# EasyEDA Pro project 主控基板_正式.epro, board 主控基板_正式
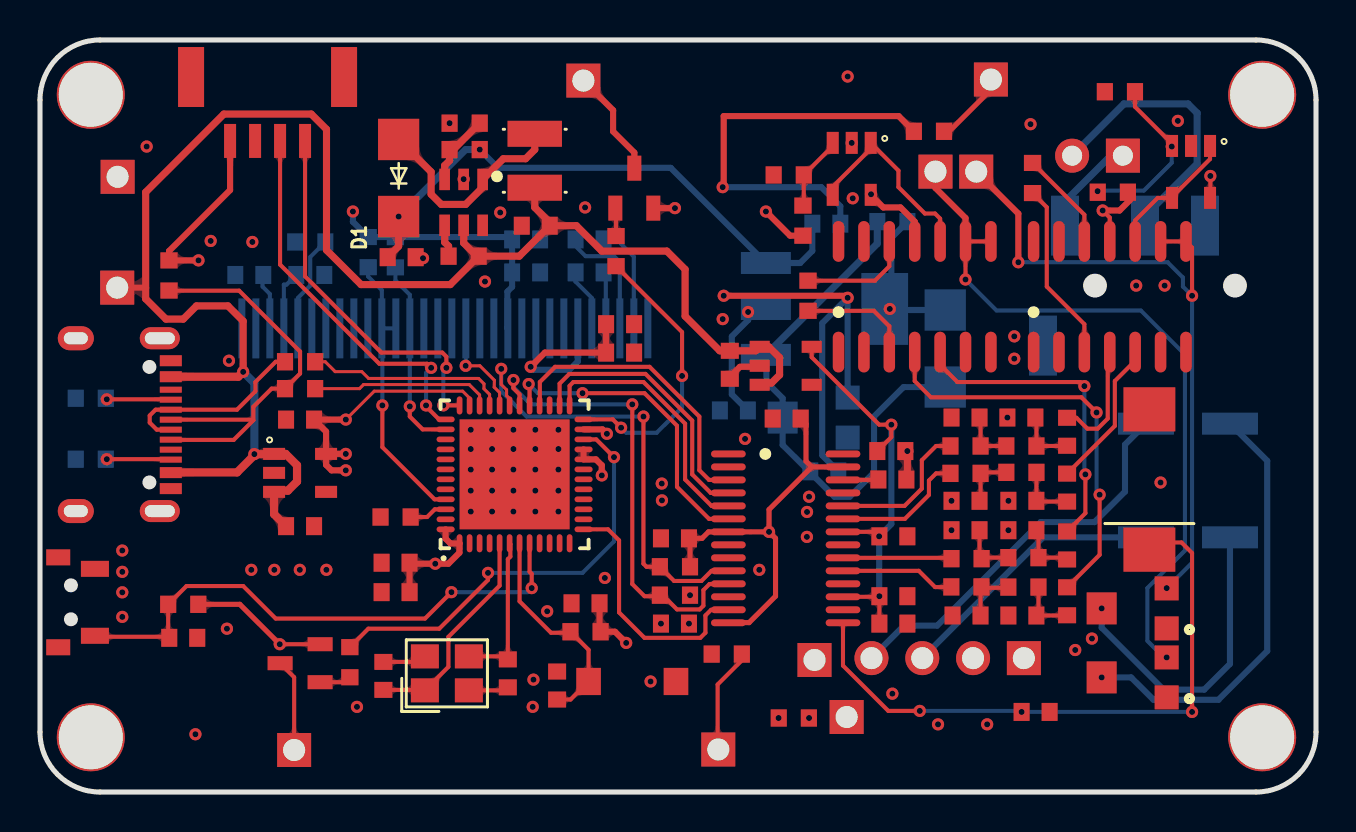
[diagram p1: board, top side]
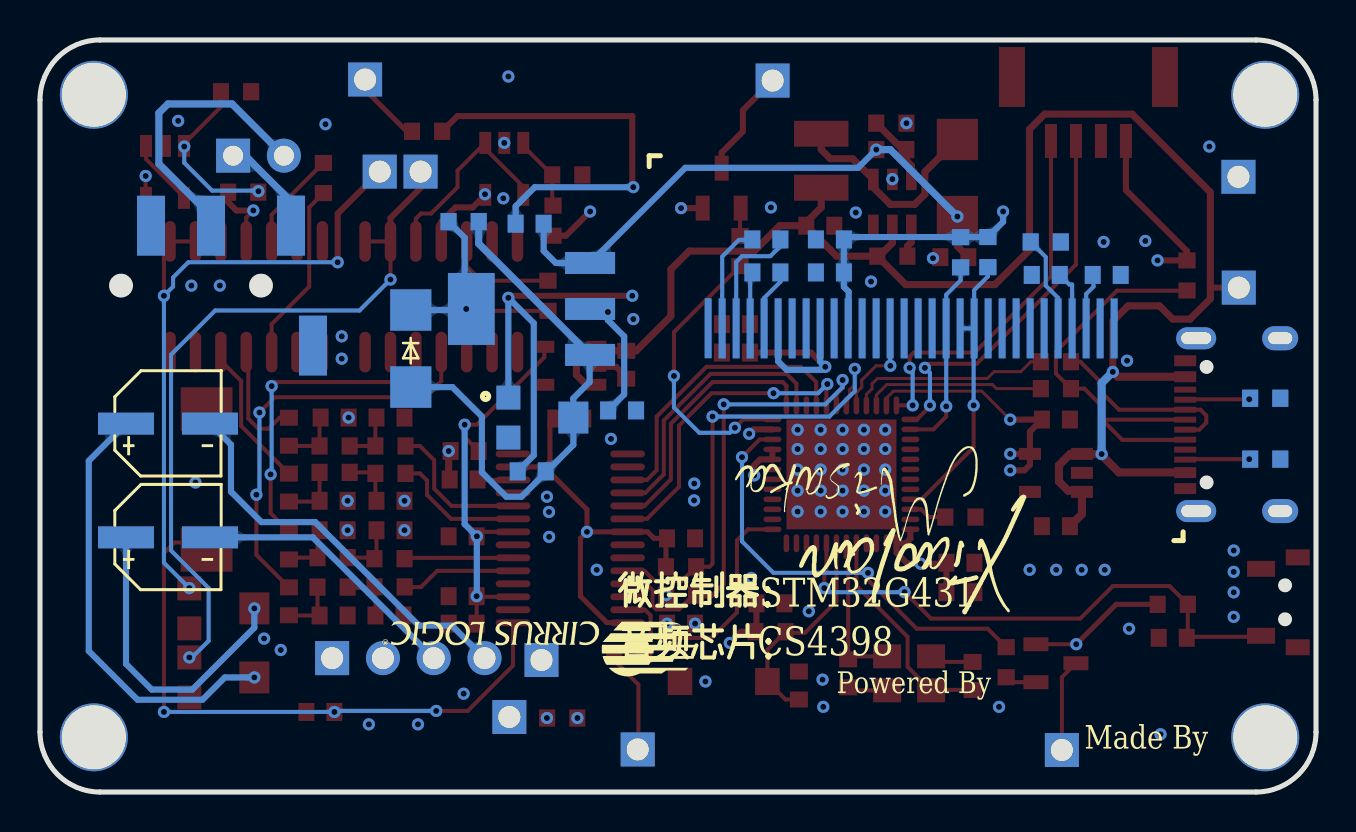
[diagram p2: board, bottom side, seen from below]

Outline 63.8 x 37.64 mm; copper layers: Top Layer, Inner1, Inner2, Bottom Layer. Coordinates in mm from the lower left corner of the outline.
Outline path: 0,34.64 0,3 arc(0.88,0.88) 3,0 60.8,0 arc(62.93,0.88) 63.8,3 63.8,34.64 arc(62.93,36.76) 60.8,37.64 3,37.64 arc(0.88,36.76) 0,34.64
Stack: Top Layer 0.035mm 外层铜厚1oz / Dielectric1 0.2104mm 7628 RC49% 8.6mil / Inner1 0.0152mm 内层铜厚 / Dielectric2 1.065mm 1.1mm H/HOZ 含铜 / Inner2 0.0152mm 内层铜厚 / Dielectric3 0.2104mm 7628 RC49% 8.6mil / Bottom Layer 0.035mm 外层铜厚1oz

## Design rules (mm)
template: 自定义配置
spacing copperThickness1oz (default): track to track 0.152, other pairs 0.152 to 0.3
spacing copperThickness2oz: track to track 0.203, other pairs 0.152 to 0.3
track width copperThickness1oz (default): min 0.127, default 0.254, max 2.54
track width copperThickness2oz: min 0.203, default 0.254, max 2.54
differential pair differentialPair (default): width min 0.127, default 0.254, max 2.54; gap min 0.152, default 0.152
via viaSize (default): diameter min 0.5, default 0.61, max 10; hole min 0.3, default 0.305, max 6.299

## Placement (name value [footprint] x y rotation side)
C1  1uF  [C0603]  13.01 13.31 180 top
C2  4.7uF  [C0603]  13.01 18.64 0 top
C7  100nF  [C0603]  17.78 11.48 0 top
C8  100nF  [C0603]  17.78 10 0 top
C9  100nF  [C0603]  29.01 23.41 180 top
C10  100nF  [C0603]  29.01 21.99 180 top
C11  100nF  [C0603]  25.86 5.33 270 top
C12  20pF  [C0603]  17.17 5.81 270 top
C13  20pF  [C0603]  23.39 5.94 90 top
C16  10uF  [C0603]  42.67 12.8 0 top
C17  22uF  [C0603]  42.67 9.8 0 top
C18  100uF  [CAP-SMD_L7.3-W4.3-R-RD]  55.47 15.64 270 top
C19  100nF  [C0603]  46.28 18.74 180 top
C20  100nF  [C0603]  46.28 14.58 0 top
C21  100nF  [C0603]  46.28 13.1 180 top
C22  100nF  [C0603]  46.33 8.84 0 top
C23  10nF  [C0603]  49.07 18.74 180 top
C24  10nF  [C0603]  49.12 14.58 0 top
C25  10nF  [C0603]  49.12 13.1 180 top
C26  10nF  [C0603]  49.12 8.84 0 top
C28  1uF  [C0603]  51.36 18.03 90 top
C29  1uF  [C0603]  51.36 15.24 90 top
C30  1uF  [C0603]  51.36 12.34 90 top
C31  1uF  [C0603]  51.36 9.55 90 top
C55  1uF  [C0603]  34.49 21.38 90 top
C56  4.7uF  [C0603]  42.57 17.06 180 top
C57  100nF  [C0603]  27.28 9.44 180 top
C58  100nF  [C0603]  42.67 8.43 180 top
C59  100nF  [C0603]  49.78 4.01 0 top
C60  100nF  [C0603]  31.75 8.43 0 top
C61  100nF  [C0603]  37.34 18.69 180 top
C62  10uF  [C0603]  31.75 12.7 180 top
C63  3.3uF  [C0603]  42.62 15.64 0 top
C64  22uF  [C0603]  24.79 28.34 0 top
C65  22uF  [C0603]  18.08 26.77 180 top
C66  100nF  [C0603]  39.32 28.44 180 bottom
C67  10uF  [C0603]  39.22 16.05 180 bottom
C68  1uF  [C0603]  34.7 19.1 0 bottom
C69  1uF  [C0603]  24.31 26.01 180 bottom
C70  1uF  [C0603]  24.31 27.66 180 bottom
C71  2.2uF  [C0603]  10.46 25.88 0 bottom
C72  4.7uF  [C0603]  13.51 25.88 180 bottom
C73  1uF  [C0603]  27.48 26.01 0 bottom
C74  1uF  [C0603]  27.48 27.66 0 bottom
C75  47uF  [CAP-SMD_BD5.0-L5.3-W5.3-LS6.0-FD]  57.4 12.75 180 bottom
C76  47uF  [CAP-SMD_BD5.0-L5.3-W5.3-LS6.0-FD]  57.4 18.44 180 bottom
C77  100nF  [C0603]  7.16 7.72 180 top
CN2  A1257WR-S-4P  [CONN-SMD_A1257WR-S-4P]  11.38 34.18 180 top
CN3  PJ-320D  [AUDIO-SMD_PJ-320D]  54.2 25.34 90 bottom
D1  SS34-MS  [DO-214AC_L4.3-W2.7-LS5.0-RD]  17.93 30.73 90 top
D2  SS34-MS  [DO-214AC_L4.3-W2.7-LS5.0-RD]  45.26 22.2 270 bottom
L2  22uH  [IND-SMD_L3.0-W3.0_FNR30XXS]  24.74 31.59 270 top
NOREF  -  [Pad_e434]  61.11 34.9 0 top
NOREF#2  -  [Pad_e24]  2.54 34.9 0 top
NOREF#3  -  [Pad_e441]  61.11 2.74 0 top
NOREF#4  -  [Pad_e435]  2.54 2.74 0 top
OLED1  N096-2864KSWEG01-H30  [OLED_0.96-30P-P0.70-12864]  20.24 22.32 180 bottom
P1  2.54-1*1P针  [HDR-TH_1P-P2.54-V-M]  12.71 2.1 0 top
P2  2.54-1*1P针  [HDR-TH_1P-P2.54-V-M]  33.92 2.13 0 top
P3  2.54-1*1P针  [HDR-TH_1P-P2.54-V-M]  27.17 35.61 0 top
P4  2.54-1*1P针  [HDR-TH_1P-P2.54-V-M]  47.55 35.66 0 top
P5  2.54-1*1P针  [HDR-TH_1P-P2.54-V-M]  46.82 31.05 0 top
P6  2.54-1*1P针  [HDR-TH_1P-P2.54-V-M]  44.78 31.05 0 top
P7  2.54-1*1P针  [HDR-TH_1P-P2.54-V-M]  3.86 25.24 0 top
P8  2.54-1*1P针  [HDR-TH_1P-P2.54-V-M]  3.88 30.79 0 top
P9  2.54-1*1P针  [HDR-TH_1P-P2.54-V-M]  40.34 3.76 0 top
P10  2.54-1*1P针  [HDR-TH_1P-P2.54-V-M]  38.73 6.61 0 top
R1  10kΩ  [RES-ADJ-SMD_3P-L3.0-W3.8-P1.75-BR]  54.71 9.19 0 top
R2  1.5kΩ  [R0603]  6.45 25.85 270 top
R3  5.1kΩ  [R0603]  2.54 16.66 180 bottom
R4  5.1kΩ  [R0603]  2.54 19.71 180 bottom
R6  1kΩ  [R0603]  27.28 8.02 180 top
R7  10kΩ  [R0603]  17.78 13.76 180 top
R14  47Ω  [R0603]  46.28 17.32 0 top
R15  47Ω  [R0603]  46.28 15.95 0 top
R16  47Ω  [R0603]  46.33 11.68 0 top
R17  47Ω  [R0603]  46.33 10.27 0 top
R18  470Ω  [R0603]  49.07 17.32 0 top
R19  470Ω  [R0603]  49.07 16 0 top
R20  470Ω  [R0603]  49.17 11.73 0 top
R21  470Ω  [R0603]  49.17 10.26 0 top
R43  4.7kΩ  [R0603]  31.75 9.85 180 top
R44  0Ω  [R0603]  37.69 3.7 180 top
R45  0Ω  [R0603]  49.63 30.73 90 top
R46  10kΩ  [R0603]  53.64 30.02 0 top
R47  10kΩ  [R0603]  54 35.05 0 top
R48  0Ω  [R0603]  38.41 24.84 90 top
R49  10kΩ  [R0603]  38.15 28.6 270 top
R50  10kΩ  [R0603]  37.44 30.88 0 top
R51  10kΩ  [R0603]  21.18 26.82 0 top
R52  19.1kΩ  [R0603]  21.23 32.15 0 top
R53  1kΩ  [R0603]  21.23 33.47 0 top
R55  1.2kΩ  [R0603]  42.62 28.55 0 bottom
R56  10kΩ  [RES-ADJ-SMD_3P-L3.0-W3.8-P1.75-BR]  38.76 18.74 0 bottom
R57  910kΩ  [R0603]  13.51 27.53 180 bottom
R58  10kΩ  [RES-ADJ-SMD_3P-L3.0-W3.8-P1.75-BR]  54.71 5.74 0 top
R59  10kΩ  [R0603]  7.16 9.39 180 top
R60  22Ω  [R0603]  13.01 20.19 0 top
R61  22Ω  [R0603]  13.01 21.53 0 top
R62  200Ω  [R0603]  34.34 6.9 0 top
R63  200Ω  [R0603]  44.45 33.07 0 top
R64  1kΩ  [R0603]  15.49 6.5 270 top
R65  1kΩ  [R0603]  28.8 27.07 90 top
R66  4.7kΩ  [R0603]  31.75 11.27 180 top
R67  4.7kΩ  [R0603]  16.41 27.02 90 bottom
R68  4.7kΩ  [R0603]  17.77 27.01 90 bottom
SW1  SKRKAEE020  [SW-SMD_L3.9-W3.0-P4.45]  29.62 5.53 0 top
SW2  TS24CA 250gf 013  [SW-SMD_L4.7-W3.5-P3.35-EH]  1.83 9.5 90 top
U1  STM32G431CBU6  [UFQFPN-48_L7.0-W7.0-P0.50-BL-EP]  23.73 15.9 0 top
U5  TPS76333DBVR  [SOT-23-5_L3.0-W1.7-P0.95-LS2.8-BR]  13.01 15.97 180 top
U9  CS4398-CZZ  [TSSOP-28_L9.7-W4.4-P0.65-LS6.4-BL]  37.29 12.7 270 top
U13  TPS76350DBVR  [SOT-23-5_L3.0-W1.7-P0.95-LS2.8-BR#2]  37.29 21.33 180 top
U14  INA163UA  [SOIC-14_L8.7-W3.9-P1.27-LS6.0-BL]  53.49 24.79 0 top
U15  OPA333AIDBVR  [SOT-23-5_L3.0-W1.7-P0.95-LS2.8-BR]  57.56 31.03 90 top
U16  INA163UA  [SOIC-14_L8.7-W3.9-P1.27-LS6.0-BL]  43.74 24.79 0 top
U17  OPA333AIDBVR  [SOT-23-5_L3.0-W1.7-P0.95-LS2.8-BR]  40.59 31.19 90 top
U18  MT3608  [SOT-23-6_L2.9-W1.6-P0.95-LS2.8-BL]  21.18 29.51 180 top
U19  LM317DCYR  [SOT-223-3_L6.5-W3.4-P2.30-LS7.0-BR]  39.27 24.18 180 bottom
U20  PM254-1-04-Z-8.5  [HDR-TH_4P-P2.54-V-F]  45.39 6.7 180 bottom
U21  PM254-1-02-Z-8.5  [HDR-TH_2P-P2.54-V-F]  52.88 31.85 180 bottom
U22  SS8550  [SOT-23-3_L2.9-W1.3-P1.90-LS2.4-BR]  13.01 6.45 0 top
U23  SS8550  [SOT-23-3_L2.9-W1.3-P1.90-LS2.4-BR]  29.72 30.22 270 top
USB1  TYPE-C 16PIN 2MD(073)  [USB-C-SMD_TYPE-C-6PIN-2MD-073]  4.17 18.39 270 top
X2  8MHz  [CRYSTAL-SMD_4P-L3.2-W2.5-BL]  20.35 5.94 0 top

## Footprints (pads in the part's own frame, mm; a bottom-side part is the same pattern mirrored in y, then rotated)
AUDIO-SMD_PJ-320D
  rect 3x1.4 smd: 1(-3,-4.05) 2(3,4.05) 3(3,1.05) 4(3,-2.95)
C0603
  rect 0.8x0.9 smd: 1(-0.7,0) 2(0.7,0)
CAP-SMD_BD5.0-L5.3-W5.3-LS6.0-FD
  rect 2.8x1.1 smd: 1(-2.1,0) 2(2.1,0)
CAP-SMD_L7.3-W4.3-R-RD
  rect 2.208x2.592 smd: 1(3.511,0) 2(-3.511,0)
CONN-SMD_A1257WR-S-4P
  rect 0.6x1.7 smd: 1(1.875,1.6) 2(0.625,1.6) 3(-0.625,1.6) 4(-1.875,1.6)
  rect 1.3x3 smd: 5(3.825,-1.6) 6(-3.825,-1.6)
CRYSTAL-SMD_4P-L3.2-W2.5-BL
  rect 1.4x1.2 smd: 1(-1.1,-0.85) 2(1.1,-0.85) 3(1.1,0.85) 4(-1.1,0.85)
DO-214AC_L4.3-W2.7-LS5.0-RD
  rect 2.07x2.06 smd: 1(-1.929,0) 2(1.929,0)
HDR-TH_1P-P2.54-V-M
  rect 1.7x1.7 hole 1.1: 1(0,0)
HDR-TH_2P-P2.54-V-F
  rect 1.7x1.7 hole 1: 1(-1.27,0)
  round 1.7 hole 1: 2(1.27,0)
HDR-TH_4P-P2.54-V-F
  rect 1.7x1.7 hole 1.1: 1(-3.81,0)
  round 1.7 hole 1.1: 2(-1.27,0) 3(1.27,0) 4(3.81,0)
IND-SMD_L3.0-W3.0_FNR30XXS
  rect 1.3x2.72 smd: 1(1.35,0) 2(-1.35,0)
OLED_0.96-30P-P0.70-12864
  rect 0.35x3 smd: 1(-10.15,0.884) 2(-9.45,0.882) 3(-8.75,0.882) 4(-8.05,0.882) 5(-7.35,0.882) 6(-6.65,0.882) 7(-5.95,0.882) 8(-5.25,0.882) 9(-4.55,0.882) 10(-3.85,0.882) 11(-3.15,0.882) 12(-2.45,0.882) 13(-1.75,0.882) 14(-1.05,0.882) 15(-0.35,0.882) 16(0.35,0.882) 17(1.05,0.882) 18(1.75,0.882) 19(2.45,0.882) 20(3.15,0.882) 21(3.85,0.882) 22(4.55,0.882) 23(5.25,0.882) 24(5.95,0.882) 25(6.65,0.882) 26(7.35,0.882) 27(8.05,0.882) 28(8.75,0.88) 29(9.45,0.879) 30(10.15,0.879)
Pad_e24
  round 3.4 hole 3.2: 50(0,0)
Pad_e434
  round 3.4 hole 3.2: 50(0,0)
Pad_e435
  round 3.4 hole 3.2: 50(0,0)
Pad_e441
  round 3.4 hole 3.2: 50(0,0)
R0603
  rect 0.806x0.864 smd: 1(-0.753,0) 2(0.753,0)
RES-ADJ-SMD_3P-L3.0-W3.8-P1.75-BR
  rect 1.2x1.2 smd: 1(1.625,-1) 3(1.625,1)
  rect 1.5x1.6 smd: 2(-1.625,0)
SOIC-14_L8.7-W3.9-P1.27-LS6.0-BL
  oval 0.574x2.038 smd: 1(-3.81,-2.769) 2(-2.54,-2.769) 3(-1.27,-2.769) 4(0,-2.769) 5(1.27,-2.769) 6(2.54,-2.769) 7(3.81,-2.769) 8(3.81,2.769) 9(2.54,2.769) 10(1.27,2.769) 11(0,2.769) 12(-1.27,2.769) 13(-2.54,2.769) 14(-3.81,2.769)
SOT-23-3_L2.9-W1.3-P1.90-LS2.4-BR
  rect 1.25x0.7 smd: 1(1,-0.95) 2(1,0.95) 3(-1,0)
SOT-23-5_L3.0-W1.7-P0.95-LS2.8-BR
  rect 1.1x0.6 smd: 1(1.3,-0.95) 2(1.3,0) 3(1.3,0.95) 4(-1.3,0.95) 5(-1.3,-0.95)
SOT-23-5_L3.0-W1.7-P0.95-LS2.8-BR#2
  rect 1x0.6 smd: 1(1.3,-0.95) 2(1.3,0) 3(1.3,0.95) 4(-1.3,0.95) 5(-1.3,-0.95)
SOT-23-6_L2.9-W1.6-P0.95-LS2.8-BL
  rect 0.532x1.072 smd: 1(-0.95,-1.149) 2(0,-1.149) 3(0.95,-1.149) 4(0.95,1.149) 5(0,1.149) 6(-0.95,1.149)
SOT-223-3_L6.5-W3.4-P2.30-LS7.0-BR
  rect 2.5x1.1 smd: 1(2.97,-2.3) 2(2.97,0) 3(2.97,2.3)
  rect 2.34x3.6 smd: 4(-2.97,0)
SW-SMD_L3.9-W3.0-P4.45
  rect 1.23x1.36 smd: 1(-2.185,0) 2(2.185,0)
SW-SMD_L4.7-W3.5-P3.35-EH
  rect 0.8x1.4 smd: 1(-1.675,-0.917) 2(1.675,-0.917)
  rect 0.8x1.2 smd: 3(-2.25,0.917) 4(2.25,0.917)
TSSOP-28_L9.7-W4.4-P0.65-LS6.4-BL
  oval 0.343x1.732 smd: 1(-4.225,-2.866) 2(-3.575,-2.866) 3(-2.925,-2.866) 4(-2.275,-2.866) 5(-1.625,-2.866) 6(-0.975,-2.866) 7(-0.325,-2.866) 8(0.325,-2.866) 9(0.975,-2.866) 10(1.625,-2.866) 11(2.275,-2.866) 12(2.925,-2.866) 13(3.575,-2.866) 14(4.225,-2.866) 15(4.225,2.866) 16(3.575,2.866) 17(2.925,2.866) 18(2.275,2.866) 19(1.625,2.866) 20(0.975,2.866) 21(0.325,2.866) 22(-0.325,2.866) 23(-0.975,2.866) 24(-1.625,2.866) 25(-2.275,2.866) 26(-2.925,2.866) 27(-3.575,2.866) 28(-4.225,2.866)
UFQFPN-48_L7.0-W7.0-P0.50-BL-EP
  oval 0.28x0.9 smd: 1(-2.751,-3.45) 2(-2.251,-3.45) 3(-1.75,-3.45) 4(-1.25,-3.45) 5(-0.749,-3.45) 6(-0.249,-3.45) 7(0.249,-3.45) 8(0.75,-3.45) 9(1.25,-3.45) 10(1.75,-3.45) 11(2.251,-3.45) 12(2.751,-3.45) 25(2.751,3.449) 26(2.251,3.449) 27(1.75,3.449) 28(1.25,3.449) 29(0.75,3.449) 30(0.249,3.449) 31(-0.249,3.449) 32(-0.749,3.449) 33(-1.25,3.449) 34(-1.75,3.449) 35(-2.251,3.449) 36(-2.751,3.449)
  oval 0.9x0.28 smd: 13(3.45,-2.751) 14(3.45,-2.251) 15(3.45,-1.75) 16(3.45,-1.25) 17(3.45,-0.75) 18(3.45,-0.249) 19(3.45,0.249) 20(3.45,0.749) 21(3.45,1.25) 22(3.45,1.75) 23(3.45,2.251) 24(3.45,2.751) 37(-3.449,2.751) 38(-3.449,2.251) 39(-3.449,1.75) 40(-3.449,1.25) 41(-3.449,0.749) 42(-3.449,0.249) 43(-3.449,-0.249) 44(-3.449,-0.75) 45(-3.449,-1.25) 46(-3.449,-1.75) 47(-3.449,-2.251) 48(-3.449,-2.751)
  rect 5.5x5.5 smd: 49(0,0)
USB-C-SMD_TYPE-C-6PIN-2MD-073
  rect 0.55x1.1 smd: 1(-3.2,2.375) 2(-2.4,2.375) 11(2.4,2.375) 12(3.2,2.375)
  rect 0.3x1.1 smd: 3(-1.75,2.375) 4(-1.25,2.375) 5(-0.75,2.375) 6(-0.25,2.375) 7(0.25,2.375) 8(0.75,2.375) 9(1.25,2.375) 10(1.75,2.375)
  oval 1.1x2 hole 0.6x1.5: 13(-4.325,1.825) 14(4.325,1.825)
  oval 1.2x1.8 hole 0.6x1.2: 13(-4.325,-2.375) 14(4.325,-2.375)

## Nets
As in the schematic.

Pads without a net: CN2 5 6; NOREF 50; NOREF#2 50; NOREF#3 50; NOREF#4 50; OLED1 7; R56 3; SW2 3 4; U1 2 3 4 9 12 15 16 17 18 19 27 39 40 41 42 43 44 47; U5 4; U9 1 2 18 25 28; U13 4; U14 1 2 7 13 14; U16 1 2 7 13 14; U18 6; USB1 3 9 13 14

## Via types
v1: diameter 0.61, hole 0.305, Top Layer to Bottom Layer, 151 vias

## Routing (per net, layer and track width the routed paths; a pad name or vN(x,y) marks a point on that pad's centre or on a via; arc(x,y) is an arc through that point)
AGND: length 1.4
  Top Layer w0.355: C63.2 43.37,15.69 v1(43.37,17.06)
  vias: v1(38.35,14.02) v1(38.35,12.77) v1(38.46,14.78) v1(38.46,3.7) v1(40.39,35.81) v1(40.59,32.49) v1(40.64,29.71) v1(42.62,4.92) v1(44.9,3.39) v1(45.58,14.58) v1(45.58,13.1) v1(47.36,3.39) v1(48.37,18.74) v1(48.42,14.58) v1(48.42,13.1) v1(48.72,22.81) v1(48.72,21.69) v1(49.53,33.42) v1(51.77,7.11) v1(52.6,7.68) v1(54.81,25.34) v1(56.03,15.49) v1(56.24,25.34) v1(56.9,33.59)
GND: length 47.3
  Top Layer w0.203: X2.4 18.97,6.51 C12.1 ; C13.1 23.24,5.09 X2.2
  Top Layer w0.305: R63.1 42.94,33.83 34.19,33.83 34.19,30.32 v1(34.14,30.27) ; C55.1 34.49,20.77 35,21.28 35.94,21.28 U13.2 ; v1(40.39,24.74) 40.28,24.84 v1(34.19,24.84)
  Bottom Layer w0.305: R56.1 v1(40.39,24.73) 39.12,23.47 39.12,16.85 C67.1 ; v1(34.14,30.27) 39.07,30.27 40.02,29.32 C66.1
  vias: v1(4.12,12.09) v1(4.12,11.02) v1(4.12,9.99) v1(4.12,8.77) v1(5.33,32.3) v1(7.77,2.89) v1(8.53,27.58) v1(9.35,8.17) v1(9.45,21.59) v1(10.57,11.12) v1(10.62,27.53) v1(11.72,11.12) v1(12.99,11.12) v1(14.32,11.12) v1(15.85,4.26) v1(19.15,26.72) v1(20.48,33.47) v1(21.18,30.67) v1(21.54,18.13) v1(21.54,17.17) v1(21.54,16.14) v1(21.54,15.08) v1(21.54,14.04) v1(22.25,25.55) v1(22.61,18.13) v1(22.61,17.17) v1(22.61,16.14) v1(22.61,15.08) v1(22.61,14.04) v1(23.01,29) v1(23.67,18.13) v1(23.67,17.17) v1(23.67,16.14) v1(23.67,15.08) v1(23.67,14.04) v1(24.67,5.63) v1(24.64,4.26) v1(24.77,18.13) v1(24.77,17.17) v1(24.77,16.14) v1(24.77,15.08) v1(24.77,14.04) v1(25.36,9.05) v1(25.92,18.13) v1(25.92,17.17) v1(25.92,16.14) v1(25.92,15.08) v1(25.92,14.04) v1(27.26,29.26) v1(28.24,10.71) v1(30.53,5.53) v1(31.05,8.43) v1(31.09,15.44) v1(31.1,14.6) v1(34.14,23.67) v1(35.26,17.67) v1(35.97,11.12) v1(36.93,3.7)
VCC3.3: length 87.8
  Top Layer w0.152: v1(15.29,18.64) 16.71,20.06 21.13,20.06 21.48,19.71 U1.35
  Top Layer w0.203: v1(11.99,7.4) U22.2
  Top Layer w0.254: 38.59,16.27 38.3,16.56 38.3,18.42 C61.1 ; 38.59,16.27 U9.27 ; 38.59,16.27 36.45,14.14 v1(36.45,13.02) ; U9.14 34.43,8.48 35.46,8.48 36.78,9.8 36.78,12.7 v1(36.45,13.02) ; v1(11.99,7.4) 9.99,9.39 R59.1 ; v1(36.45,13.02) U9.7 33.43,13.02 33.1,12.7 C62.1 32.5,12.64 R66.1
  Top Layer w0.305: U23.2 v1(31.75,29.22) ; U1.23 28.13,18.15 v1(28.35,17.93) ; v1(24.54,21.28) 25.25,21.99 C10.2 C9.2 ; v1(15.29,16.1) 14.58,16.1 14.3,16.37 U5.5 ; v1(7.92,26.61) R2.1 6.45,27.07 9.51,30.13 CN2.1 ; C8.2 C7.2 18.53,11.43 v1(19.77,11.43) 20.42,11.43 20.97,11.98 20.97,12.44 ; U5.5 14.3,18.04 C2.2 v1(15.29,18.64) ; U5.5 v1(15.29,16.92) ; C57.1 27.98,8.08 R6.1 28.75,8.02 v1(29.31,7.46) ; 20.97,12.44 20.52,12.44 20.28,12.68 U1.48 ; 20.97,12.44 U1.1 ; U1.21 U1.20 27.8,16.65 28.09,16.35 v1(28.09,15.85)
  Bottom Layer w0.305: 17.76,27.78 17.77,27.77 ; 17.76,27.78 R67.2 15.65,28.54 v1(15.65,29.05) ; 17.76,27.78 23.49,27.78 C70.2 C69.2 23.61,25.28 23.37,25.04 23.37,23.23 23.39,23.2 ; 24.79,23.2 24.79,21.54 v1(24.54,21.28) 24.69,21.13 26.47,21.13 26.89,21.55 26.89,23.2
  vias: v1(32.45,8.43) v1(32.5,9.85)
VCC12: length 28.3
  Top Layer w0.355: C65.2 17.93,27.31 v1(17.93,28.8)
  Bottom Layer w0.305: v1(21.99,32.15) 22.9,31.24 31.54,31.24 U19.3 38.01,26.48 38.62,27.08 C66.2
  Bottom Layer w0.355: v1(17.93,28.8) 21.28,32.15 v1(21.99,32.15)
VCC_OP: length 24.4
  Top Layer w0.203: v1(53.14,29.1) 53.49,28.75 U14.11 ; U15.5 58.52,29.75 v1(58.52,30.83)
  Top Layer w0.305: R49.2 37.51,27.84 v1(36.3,29.05) ; v1(53.14,29.1) 53.98,29.1 54.5,29.62 54.5,30.02 ; U16.11 43.74,28.55 43.03,29.26 42.17,29.26 U17.5
  Bottom Layer w0.305: R55.2 42.57,27.74 42.57,24.51 U19.4 42.29,24.12 45.26,24.12 ; C68.2 34.6,19.9 34.6,22.81 35.41,23.62 v1(35.41,24.02)
  vias: v1(41.55,29.92) v1(42.49,24.18)
VIN: length 86.4
  Top Layer w0.305: P7.1 5.27,25.24 5.28,25.23
  Top Layer w0.355: C64.2 23.97,26.82 R51.2 ; C64.2 26.82,28.34 28.09,27.07 31.34,27.07 32.26,26.16 32.26,23.81 33.99,22.08 C55.2 35.79,22.08 U13.1 36.44,22.28 36.98,21.74 36.98,20.87 36.58,20.47 36.07,20.47 U13.3 ; C64.2 25.49,28.51 24.74,29.26 L2.1 ; v1(10.16,21.03) 10.16,23.57 9.4,24.33 7.82,24.33 7.16,23.67 6.3,23.67 5.28,24.68 5.28,30.02 9.2,33.93 13.56,33.93 14.33,33.17 14.33,27.12 16.05,25.4 20.52,25.4 R51.2 ; R51.2 21.84,26.82 21.18,27.48 U18.5
  Top Layer w0.406: USB1.11 6.55,16 9.86,16 10.77,16.91 11.69,16.91 U5.1 12.28,16.92 12.85,16.35 12.85,15.54 12.4,15.08 11.77,15.08 11.7,15.02 11.7,13.91 C1.2 ; USB1.2 9.92,20.79 v1(10.16,21.03)
  Bottom Layer w0.406: v1(10.72,16.91) 10.72,20.47 v1(10.16,21.03)
AMPL_OUT: length 5.1
  Bottom Layer w0.355: CN3.4 51.25,29.56 53.54,31.85 54.15,31.85
AMPR_OUT: length 14.2
  Bottom Layer w0.355: U21.2 54.2,34.44 57.4,34.44 57.86,33.98 57.86,31.44 55.25,28.83 CN3.3
DACRST: length 12.7
  Top Layer w0.203: U1.13 28.4,13.15 28.96,12.59 28.96,8.99 30.23,7.72 33.02,7.72 33.27,7.97 33.27,8.84 33.56,9.12 U9.13
DACSCL: length 22.9
  Top Layer w0.152: U1.31 23.48,19.69 23.33,19.84 23.33,20.13 23.07,20.39 23.07,21.18
  Top Layer w0.203: U9.10 33.58,11.07 33.07,10.56 31.71,10.56 R66.2 30.33,11.27 30.18,11.43 v1(30.18,18.79)
  Bottom Layer w0.203: v1(30.18,18.79) 24.33,18.79 23.06,20.06 v1(23.06,21.18)
DACSDA: length 23.4
  Top Layer w0.203: v1(23.67,20.62) 23.67,20.21 23.98,19.9 U1.30 ; v1(29.62,19.4) 29.62,10.41 30.23,9.8 30.95,9.8 ; U9.11 34.41,10.41 33.48,10.41 33.17,10.11 33.17,9.33 32.99,9.14 31.85,9.14 31.19,9.8 30.95,9.8 ; 30.95,9.8 R43.2
  Bottom Layer w0.203: v1(23.67,20.62) 23.67,20.27 24.54,19.4 v1(29.62,19.4)
I2S_LRCLK: length 13.2
  Top Layer w0.203: U1.25 26.48,20.33 26.67,20.52 30.18,20.52 32.26,18.44 32.26,15.64 33.58,14.32 U9.5
I2S_MCLK: length 15.7
  Top Layer w0.203: v1(27.13,19.96) 30.23,19.96 31.85,18.33 31.85,15.27 33.45,13.67 U9.6 ; U1.29 24.48,20.37 v1(24.44,20.42)
  Bottom Layer w0.203: v1(27.13,19.96) 24.89,19.96 v1(24.44,20.42)
I2S_SCLK: length 13.8
  Top Layer w0.203: U9.4 33.54,14.97 32.61,15.9 32.61,18.59 30.28,20.93 26.47,20.93 25.98,20.44 U1.26
I2S_SDIN: length 14.8
  Top Layer w0.203: U1.28 24.99,19.36 24.99,20.52 25.76,21.28 30.48,21.28 32.97,18.79 32.97,16.11 33.45,15.62 U9.3
INL+: length 7.5
  Top Layer w0.203: C29.2 53.75,18.32 53.75,20.57 54.76,21.59 U14.5
INL-: length 5.8
  Top Layer w0.203: C28.2 51.83,18.73 52.38,18.18 52.88,18.18 53.39,18.69 53.39,21.92 U14.4
INR+: length 16
  Top Layer w0.203: v1(52.22,20.32) 52.02,20.52 45.87,20.52 45.01,21.38 U16.5 ; v1(52.27,15.9) 52.27,13.95 C30.2
  Bottom Layer w0.203: v1(52.27,15.9) 52.22,15.95 v1(52.22,20.32)
INR-: length 20.7
  Top Layer w0.203: U16.4 43.74,20.57 44.55,19.76 52.07,19.76 v1(52.83,19) ; C31.2 52.98,11.87 v1(52.98,14.88)
  Bottom Layer w0.203: v1(52.98,14.88) 52.83,15.03 v1(52.83,19)
KEY: length 27.5
  Top Layer w0.203: 6.41,7.77 2.8,7.77 SW2.1 ; 6.41,7.77 R59.2 7.32,10.31 10.16,10.31 11.79,8.68 19.25,8.68 v1(20.57,10) ; 6.41,7.77 C77.2 ; v1(24.59,10.21) 24.59,10.92 24.48,11.03 U1.8
  Bottom Layer w0.203: v1(24.59,10.21) 24.38,10 v1(20.57,10)
L_OUT: length 13.7
  Bottom Layer w0.305: U20.3 50.16,12.75 C75.2
LED1: length 21.7
  Top Layer w0.203: v1(28.7,16.76) 27.81,17.65 U1.22 ; v1(22.4,10.97) 22.4,10.61 19.96,8.17 16.42,8.17 R64.1
  Bottom Layer w0.203: v1(22.4,10.97) 27.13,10.97 28.7,12.54 v1(28.7,16.76)
LED2: length 14.2
  Top Layer w0.203: U1.24 28.64,18.65 v1(29.06,18.23) ; v1(32.11,20.82) 32.11,23.02 R65.1
  Bottom Layer w0.203: v1(29.06,18.23) 29.31,17.98 30.84,17.98 32.11,19.25 v1(32.11,20.82)
NRST: length 10.9
  Top Layer w0.203: U1.7 23.98,9.54 25.55,7.97 26.48,7.97 R6.2 27.43,7.12 SW1.1 26.53,4.63 C11.2
OLED_RES: length 5
  Top Layer w0.152: v1(21.29,21.33) 22,21.33 22.72,20.61 22.71,20.26 22.98,19.99 U1.32
  Bottom Layer w0.203: v1(21.29,21.33) 21.29,21.34 21.29,23.2
OLED_SCL: length 9.8
  Top Layer w0.203: U1.38 19.13,18.15 18.49,18.79 v1(18.49,19.3)
  Bottom Layer w0.203: R68.1 17.77,25.61 18.49,24.89 18.49,23.2 ; OLED1.18 18.49,23.2 ; 18.49,23.2 v1(18.49,19.3)
OLED_SDA: length 14.2
  Top Layer w0.203: U1.45 19.73,14.65 17.12,17.26 v1(17.12,19.35)
  Bottom Layer w0.203: v1(17.12,19.35) 17.12,23.18 OLED1.20 ; OLED1.20 17.09,25.12 16.41,25.8 R67.1 ; OLED1.20 17.79,23.2
OSC_IN: length 11
  Top Layer w0.203: U1.5 22.98,10.33 20.42,7.77 20.42,6.27 X2.1 19.22,5.11 C12.2
OSC_OUT: length 7.9
  Top Layer w0.203: X2.3 23.24,6.79 C13.2 23.39,11.65 23.52,11.78 23.52,12.41 U1.6
OUTA+: length 6.7
  Top Layer w0.203: R15.1 44.81,15.95 44.45,15.59 44.45,14.87 43.25,13.67 U9.23
OUTA-: length 7.4
  Top Layer w0.203: R14.1 44.81,17.32 44.09,16.61 44.09,15.19 43.23,14.32 U9.24
OUTB+: length 5.4
  Top Layer w0.203: U9.20 45.54,11.72 R16.1
OUTB-: length 5.8
  Top Layer w0.203: R17.1 45.56,10.26 44.76,10.26 43.94,11.07 U9.19
R_OUT: length 20
  Bottom Layer w0.305: C76.2 54.25,17.39 54.25,15.03 52.73,13.51 50.04,13.51 44.86,8.33 43.2,8.33 U20.4
SWCLK: length 19.2
  Top Layer w0.203: v1(19.56,21.23) 19.36,21.43 16.97,21.43 12,26.4 CN2.3 ; U1.37 19.95,18.65 19.3,19.3 v1(19.3,19.35)
  Bottom Layer w0.203: v1(19.3,19.35) 19.3,20.98 v1(19.56,21.23)
SWDIO: length 18.8
  Top Layer w0.203: v1(20.17,19.35) 20.98,19.35 U1.36 ; CN2.4 13.25,25.81 17.07,21.99 20.12,21.99 20.32,21.79 v1(20.32,21.23)
  Bottom Layer w0.203: v1(20.17,19.35) 20.17,21.08 v1(20.32,21.23)
USB+: length 21.3
  Top Layer w0.203: 10.67,18.61 9.69,17.62 6.55,17.62 USB1.8 ; 10.67,18.61 10.67,19.28 11.58,20.19 R60.1 13.01,20.94 13.01,22.04 9.96,25.09 6.46,25.09 R2.2 ; 10.67,18.61 10.64,18.64 USB1.6
USB-: length 9.7
  Top Layer w0.203: USB1.7 5.84,18.14 5.49,18.49 5.49,18.84 5.78,19.14 USB1.5 9.85,19.14 10.77,20.05 10.77,20.52 11.79,21.53 R61.1
VA: length 21.5
  Top Layer w0.203: C56.2 42.57,17.76 v1(42.57,18.39) 41.96,18.39 38.59,21.76 U13.5 ; C58.2 v1(41.97,9.8) 41.94,9.77 U9.17 ; U9.22 41.65,13.02 41.97,12.7
  Bottom Layer w0.305: v1(42.57,18.39) 42.57,13.41 v1(41.96,12.8) 41.96,9.81 v1(41.97,9.8)
$1N1038: length 3.2
  Top Layer w0.203: 6.54,16.63 6.52,16.66 v1(3.34,16.66)
$1N1066: length 3.2
  Top Layer w0.203: 6.54,19.63 6.52,19.66 v1(3.34,19.66)
$1N1850: length 1.9
  Top Layer w0.203: R7.1 19.36,13.76 19.74,14.15 U1.46
$1N5259: length 1.8
  Top Layer w0.203: U9.26 41.9,15.62 C63.1
$1N5273: length 2.7
  Top Layer w0.203: R18.1 R14.2 47.03,18.69 C19.1
$1N5274: length 2.7
  Top Layer w0.203: R19.1 47.08,16 R15.2 47.03,14.63 C20.2
$1N5275: length 2.9
  Top Layer w0.203: 47.03,10.22 48.38,10.22 R21.1 ; 47.03,10.22 47.08,10.27 ; 47.03,10.22 C22.2
$1N5276: length 2.8
  Top Layer w0.203: C21.1 46.98,11.89 47.13,11.73 ; R16.2 47.13,11.73 ; 47.13,11.73 R20.1
$1N5283: length 3
  Top Layer w0.203: C28.1 51.35,17.32 R18.2 49.83,18.69 C23.1
$1N5284: length 3
  Top Layer w0.203: R19.2 49.83,14.58 ; 49.83,14.58 49.87,14.54 C29.1 ; 49.83,14.58 C24.2
$1N5285: length 3
  Top Layer w0.203: R21.2 49.93,8.94 C26.2 51.35,8.84 C31.1
$1N5286: length 2.9
  Top Layer w0.203: C30.1 51.27,11.73 R20.2 49.93,13 C25.1
$1N5300: length 30.9
  Top Layer w0.203: 55.47,12.49 57.08,12.49 57.61,11.96 v1(57.61,4.01) ; U9.15 40.15,6.33 42.42,4.06 v1(43.99,4.06)
  Bottom Layer w0.203: v1(57.61,4.01) v1(49.08,4.01) 49.03,4.06 v1(43.99,4.06)
$1N10371: length 9
  Top Layer w0.203: R45.1 50.34,29.27 50.34,25.29 52.22,23.41 U14.3
$1N10376: length 5
  Top Layer w0.203: R45.2 52.22,28.89 U14.12
$1N10420: length 6.8
  Top Layer w0.203: 56.56,29.73 55.89,29.73 54.76,28.61 U14.10 ; 56.56,29.73 58.51,31.68 U15.1 ; 56.56,29.73 U15.4
$1N10554: length 8.7
  Top Layer w0.203: v1(56.59,32.3) 56.59,32.46 54.75,34.29 R47.2 ; 52.99,30.02 52.94,30.07 v1(52.88,30.07)
  Bottom Layer w0.203: v1(52.88,30.07) 52.91,30.1 55.2,30.1 56.59,31.49 v1(56.59,32.3)
$1N10899: length 5.7
  Top Layer w0.203: R48.1 41.7,24.08 42.47,23.31 U16.3
$1N10903: length 5.6
  Top Layer w0.203: R48.2 41.75,25.59 42.47,26.31 U16.12
$1N10917: length 9.6
  Top Layer w0.203: 39.64,30.29 41.54,32.19 U17.1 42.93,31.1 42.93,30.27 44.25,28.95 44.76,28.95 45.01,28.7 U16.10
$1N10922: length 3.8
  Top Layer w0.203: R49.1 38.19,29.39 R50.2 39.64,32.33 U17.3
$1N11289: length 1.6
  Top Layer w0.355: R51.1 20.43,27.32 20.23,27.51 20.23,28.36
$1N11420: length 11
  Top Layer w0.355: L2.2 24.74,32.15 24.28,31.7 23.17,31.7 U18.1 22.13,30.26 21.29,29.41 20.07,29.41 19.56,29.92 19.56,31.03 D1.2
$1N11519: length 3.6
  Top Layer w0.355: R53.2 20.67,32.15 R52.1 20.48,31.6 20.23,31.35 20.23,30.66
$1N12080: length 27
  Bottom Layer w0.305: 38.52,15.99 37.14,17.37 R56.2 37.14,19.71 36.32,20.52 36.32,21.85 U19.1 ; 38.52,15.99 39.73,14.78 40.49,14.78 41.71,16 41.71,18.79 43.18,20.27 D2.2 ; 38.52,15.99 C67.2
  Bottom Layer w0.355: R55.1 41.87,27.45 U19.1
$1N12830: length 2.8
  Bottom Layer w0.203: OLED1.28 11.49,24.93 11.13,25.29 11.13,25.84 C71.2
$1N12856: length 3
  Bottom Layer w0.203: OLED1.27 12.19,25.4 12.33,25.4 C72.2
$1N12948: length 2.8
  Bottom Layer w0.203: C73.2 28.29,25.89 28.29,23.2
$1N12974: length 5.5
  Bottom Layer w0.203: OLED1.2 29.69,26.79 28.85,27.63 28.21,27.63 C74.2
$1N12978: length 3.1
  Bottom Layer w0.203: C73.1 26.77,25.99 26.77,25.55 27.59,24.73 OLED1.5
$1N12986: length 6.2
  Bottom Layer w0.203: OLED1.3 28.99,26.53 28.7,26.82 27.28,26.82 26.78,27.31 C74.1
$1N13016: length 4.9
  Bottom Layer w0.203: 12.89,23.2 12.89,24.73 13.51,25.34 13.51,26.78 R57.1
$1N13586: length 21.9
  Bottom Layer w0.305: C76.1 61.37,16.57 61.37,7.06 58.93,4.62 55.68,4.62 54.56,5.74 v1(53.09,5.74)
$1N13588: length 15.5
  Bottom Layer w0.305: v1(53.09,9.19) 53.09,8.23 56.19,5.13 58.22,5.13 59.5,6.41 C75.1
$1N13592: length 34.3
  Top Layer w0.203: U14.9 U14.8 57.61,27.25 v1(57.61,24.84)
  Top Layer w0.305: v1(48.92,26.51) 48.92,28.95 P5.1
  Bottom Layer w0.203: v1(48.92,26.51) 56.39,26.51 57.15,25.75 57.15,25.29 v1(57.61,24.84) 57.61,11.48 v1(56.34,10.21)
$1N13598: length 36.2
  Top Layer w0.203: v1(46.28,25.65) U16.9 U16.8
  Top Layer w0.305: U16.9 46.28,28.73 44.78,30.23 P6.1
  Bottom Layer w0.203: v1(46.28,25.65) 47.83,24.1 55.04,24.1 57.25,21.89 57.25,12.09 55.37,10.21 55.37,7.56 56.2,6.74 v1(56.34,6.74)
$1N13854: length 9
  Top Layer w0.152: R60.2 15.98,20.19 16.18,20.39 21.46,20.39 21.98,19.87 U1.34
$1N13880: length 10.1
  Top Layer w0.152: R61.2 14.26,21.53 14.76,21.04 16.09,21.04 16.43,20.7 21.93,20.7 22.2,20.43 22.2,20.18 22.48,19.9 U1.33
$1N14454: length 1.6
  Top Layer w0.203: U22.1 15.25,5.5 R64.2
$1N14480: length 1.4
  Top Layer w0.203: U23.1 28.8,29.19 R65.2
$1N14547: length 4.6
  Top Layer w0.203: U22.3 12.71,5.74 P1.1
$1N14590: length 5.3
  Top Layer w0.203: P2.1 33.88,2.17 33.88,5.38 35.09,6.59 R62.2
$1N14633: length 5.4
  Top Layer w0.305: P3.1 28.66,34.12 28.66,33.06 29.72,32 U23.3
$1N14676: length 3.7
  Top Layer w0.254: R63.2 45.47,33.07 47.55,35.15 P4.1

## Copper pours and planes (outline as drawn; the poured copper is in the pictures)
AGND on Top Layer: 35.2,39.16 35.2,24.46 36.09,23.57 37.16,23.57 37.85,22.88 37.85,20.2 38.65,19.39 38.65,17.35 37.69,16.39 37.69,-0.78 61.4,-0.78 65.63,3.45 65.63,39.31 35.36,39.31
AGND on Bottom Layer: 35.2,39.16 35.2,24.46 36.09,23.57 37.16,23.57 37.85,22.88 37.85,20.2 38.65,19.39 38.65,17.35 37.69,16.39 37.69,-1.39 62.67,-1.39 66.09,2.03 64.57,37.79 37.03,40.99
GND on Top Layer: 34.75,36.17 34.75,23.57 35.44,22.88 37.34,22.61 37.38,-0.77 2.39,-0.77 -1.68,3.3 -1.68,33.93 3.81,39.42 34.8,39.42 34.8,36.22
GND on Bottom Layer: 34.68,36.31 34.68,23.71 35.38,23.02 37.27,22.75 37.31,-1.44 2.02,-1.44 -1.74,2.32 -1.74,34.07 7.1,42.91 34.73,42.91 34.73,36.36
GND on Inner1: 34.7,36.17 34.7,23.57 35.39,22.88 37.29,22.61 37.32,-0.56 2.49,-0.56 -1.73,3.65 -1.73,33.93 1.73,37.38 34.75,37.38 34.75,36.22
VCC3.3 on Inner2: 34.73,36.24 34.73,23.65 35.42,22.96 37.32,22.68 37.36,-0.69 2.83,-0.69 -7.43,9.57 -7.43,28.27 2.32,38.02 34.78,38.02 34.78,36.29
VCC_OP on Inner2: 35.31,37.69 35.31,23.92 36,23.23 37.83,23.23 37.83,0.63 43.01,-4.56 57.47,-4.56 64.8,2.76 64.8,34.82 61.93,37.69

Small or netless copper shapes (teardrops, artwork), in the pictures only: 281 on Top Layer, 112 on Bottom Layer

## Text on the board
Bottom Silkscreen Layer: Powered By | Made By | STM32G431 | CS4398 | 音频芯片: | 微控制器:
